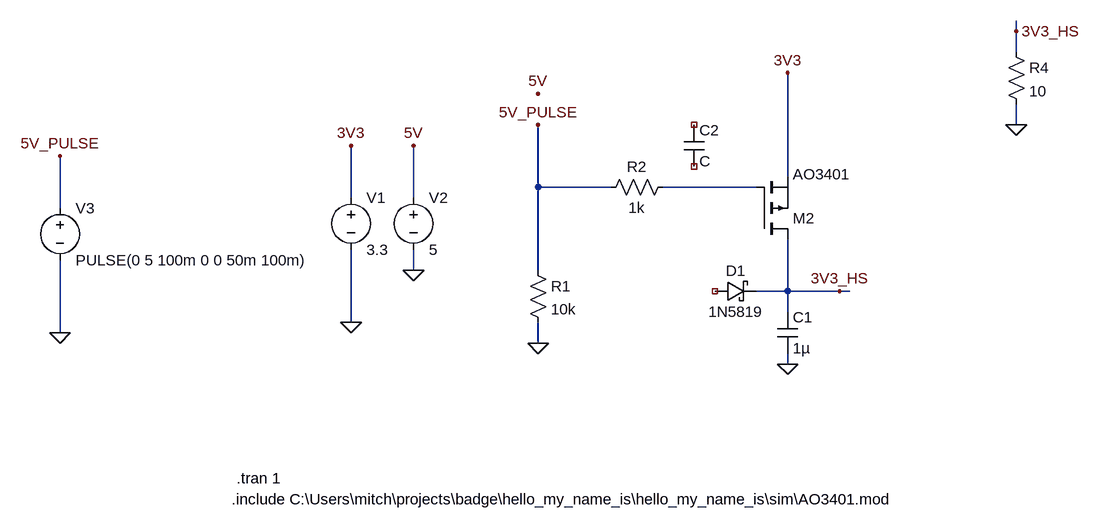
[diagram p0: schematic usb_pwr_sel.asc]
usb_pwr_sel.asc, the LTspice schematic file:
Version 4
SHEET 1 1272 680
WIRE 528 -112 528 -128
WIRE 528 -80 528 -112
WIRE 528 32 528 0
WIRE 176 112 176 -48
WIRE -208 128 -208 32
WIRE -96 128 -208 128
WIRE 128 128 -16 128
WIRE -496 144 -496 64
WIRE -400 144 -400 64
WIRE -944 160 -944 80
WIRE -400 256 -400 224
WIRE -208 256 -208 128
WIRE 176 288 176 208
WIRE 176 288 128 288
WIRE 256 288 176 288
WIRE 272 288 256 288
WIRE 176 320 176 288
WIRE -496 336 -496 224
WIRE -944 352 -944 240
WIRE -208 368 -208 336
WIRE 176 400 176 384
FLAG -496 64 3V3
FLAG -400 256 0
FLAG -400 64 5V
FLAG -208 -16 5V
FLAG 528 32 0
FLAG -944 80 5V_PULSE
FLAG -944 352 0
FLAG -496 336 0
FLAG 176 400 0
FLAG -208 368 0
FLAG 176 -48 3V3
FLAG 256 288 3V3_HS
FLAG 528 -112 3V3_HS
FLAG -208 32 5V_PULSE
SYMBOL voltage -496 128 R0
WINDOW 123 0 0 Left 0
WINDOW 39 0 0 Left 0
SYMATTR InstName V1
SYMATTR Value 3.3
SYMBOL voltage -400 128 R0
WINDOW 123 0 0 Left 0
WINDOW 39 0 0 Left 0
SYMATTR InstName V2
SYMATTR Value 5
SYMBOL res 512 -96 R0
SYMATTR InstName R4
SYMATTR Value 10
SYMBOL voltage -944 144 R0
WINDOW 123 0 0 Left 0
WINDOW 39 0 0 Left 0
SYMATTR InstName V3
SYMATTR Value PULSE(0 5 100m 0 0 50m 100m)
SYMBOL cap 160 320 R0
SYMATTR InstName C1
SYMATTR Value 1µ
SYMBOL pmos 128 208 M180
WINDOW 3 56 72 Invisible 2
WINDOW 38 56 100 Left 2
SYMATTR Value ""
SYMATTR SpiceModel AO3401
SYMATTR InstName M2
SYMATTR Prefix X
SYMBOL res -224 240 R0
SYMATTR InstName R1
SYMATTR Value 10k
SYMBOL schottky 64 304 R270
WINDOW 0 32 32 VTop 2
WINDOW 3 0 32 VBottom 2
SYMATTR InstName D1
SYMATTR Value 1N5819
SYMATTR Description Diode
SYMATTR Type diode
SYMBOL res 0 112 R90
WINDOW 0 0 56 VBottom 2
WINDOW 3 32 56 VTop 2
SYMATTR InstName R2
SYMATTR Value 1k
SYMBOL cap 16 32 R0
SYMATTR InstName C2
TEXT -680 608 Left 2 !.include C:\\Users\\mitch\\projects\\badge\\hello_my_name_is\\hello_my_name_is\\sim\\AO3401.mod
TEXT -672 576 Left 2 !.tran 1

The netlist it stands for:
* usb_pwr_sel.asc
V1 3V3 0 3.3
V2 5V 0 5
R4 3V3_HS 0 10
V3 5V_PULSE 0 PULSE(0 5 100m 0 0 50m 100m)
C1 3V3_HS 0 1µ
XM2 3V3_HS N001 3V3 AO3401  ; pins D G S
R1 5V_PULSE 0 10k
D1 NC_01 3V3_HS 1N5819
R2 N001 5V_PULSE 1k
C2 NC_02 NC_03 C
.model D D
.lib standard.dio
.include C:\Users\mitch\projects\badge\hello_my_name_is\hello_my_name_is\sim\AO3401.mod
.tran 1
.backanno
.end